# EAGLE design terminal (EAGLE 6.5.0)
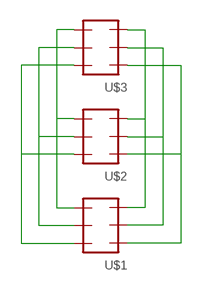
[diagram p0: schematic, sheet 1]

## Parts
U$1  PIN_HEADER_32  [PIN_HEADER_3*2]
U$2  PIN_HEADER_32  [PIN_HEADER_3*2]
U$3  PIN_HEADER_32  [PIN_HEADER_3*2]

## Nets
N$1: U$1.P$3 U$2.P$3 U$3.P$3
N$2: U$1.P$2 U$2.P$2 U$3.P$2
N$3: U$1.P$1 U$2.P$1 U$3.P$1
N$4: U$1.P$6 U$2.P$6 U$3.P$6
N$5: U$1.P$5 U$2.P$5 U$3.P$5
N$6: U$1.P$4 U$2.P$4 U$3.P$4

## Library data of the parts
U$1-U$3 = 08_CONECTOR:PIN_HEADER_3*2

## Board
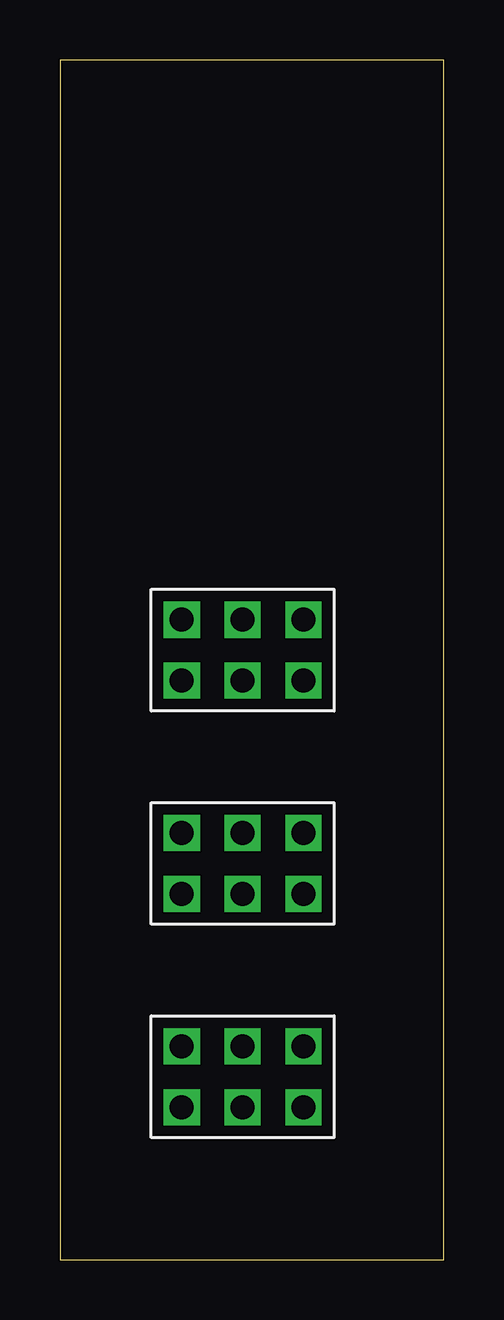
[diagram p1: board, top side]
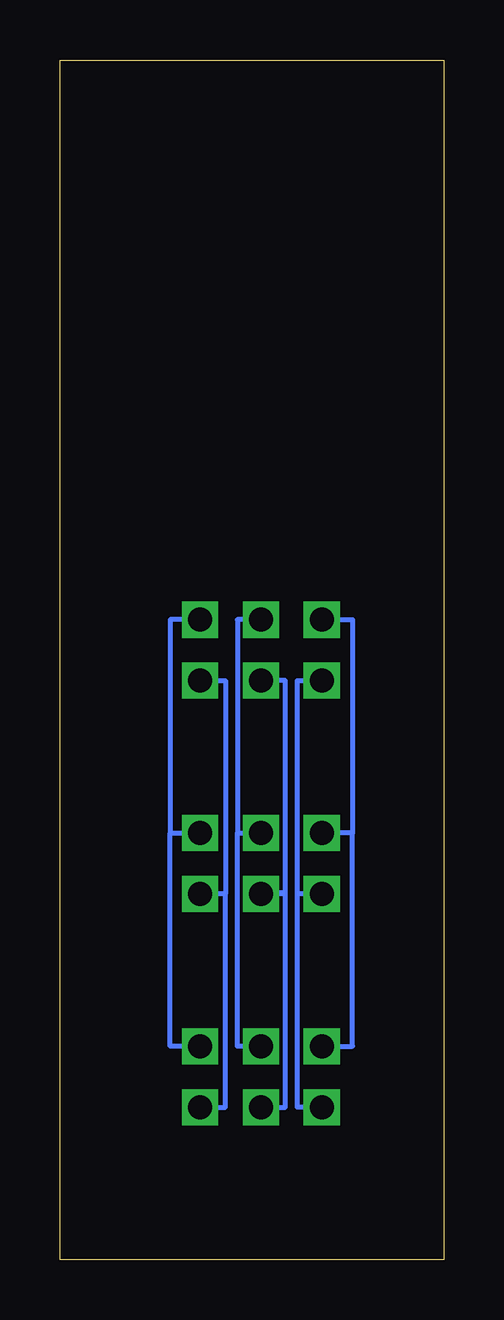
[diagram p2: board, bottom side, seen from below]

Size 16 x 50 mm. Coordinates in mm from the lower left corner, seen from the top.
Outline: 0,0 16,0 16,50 0,50 0,0
Copper layers (1*16): Top 0.035mm / dielectric 1.5mm / Bottom 0.035mm
Design rules "default": minimum track width 10mil, minimum drill 24mil, track to track 8mil, track to pad 8mil, pad to pad 8mil, via to via 8mil, smd to smd 8mil, copper to edge 40mil, drill to drill 8mil, minimum pad ring 10mil, minimum via ring 8mil, stop-mask expansion 4mil, vias tented up to drill 0mil, thermal gap 10mil

### Footprints (pad centres in the part's own frame; a part is rotated, then mirrored left to right if it is on the bottom)
PIN_HEADER_3*2 = drill 1 pad 1.5 square: P$1 -2.54,0; P$2 0,0; P$3 2.54,0; P$4 -2.54,-2.54; P$5 0,-2.54; P$6 2.54,-2.54

### Placement (x,y rotation side)
U$1  7.62,6.35 180 top
U$2  7.62,15.24 180 top
U$3  7.62,24.13 180 top

### Tracks (layer width: path | path; a pad name or v marks a point on that pad's centre or on a via)
N$1
  Bottom 0.2: U$1.P$3 6.1,6.35 6.1,15.24 | U$2.P$3 6.1,15.24 | 6.1,15.24 6.1,24.13 U$3.P$3
N$2
  Bottom 0.2: U$1.P$2 6.6,6.35 6.6,15.24 U$2.P$2 7.62,15.3 6.6,15.3 6.6,24.13 U$3.P$2
N$3
  Bottom 0.2: U$1.P$1 9.1,6.35 9.1,14.7 9.1,15.24 | 9.1,15.24 U$2.P$1 | U$3.P$1 9.1,24.13 9.1,15.24
N$4
  Bottom 0.2: U$1.P$6 3.8,8.89 3.8,17.78 | 3.8,17.78 U$2.P$6 | U$3.P$6 3.8,26.67 3.8,17.78
N$5
  Bottom 0.2: U$1.P$5 8.6,8.89 8.6,17.78 | 8.6,17.78 U$2.P$5 | U$3.P$5 8.6,26.67 8.6,17.78
N$6
  Bottom 0.2: U$3.P$4 11.4,26.67 11.4,17.78 | 11.4,17.78 U$2.P$4 | U$1.P$4 11.4,8.89 11.4,17.78